# Altium project S7CAS-PLEIADES-CARTE-MERE.PrjPCB (part 3 of 3)

## Sheet CM_USB.SchDoc
size Tabloid; SheetNumber: 14; SheetTotal: 14; Sheet_Name: CM_USB; Size: 11x17
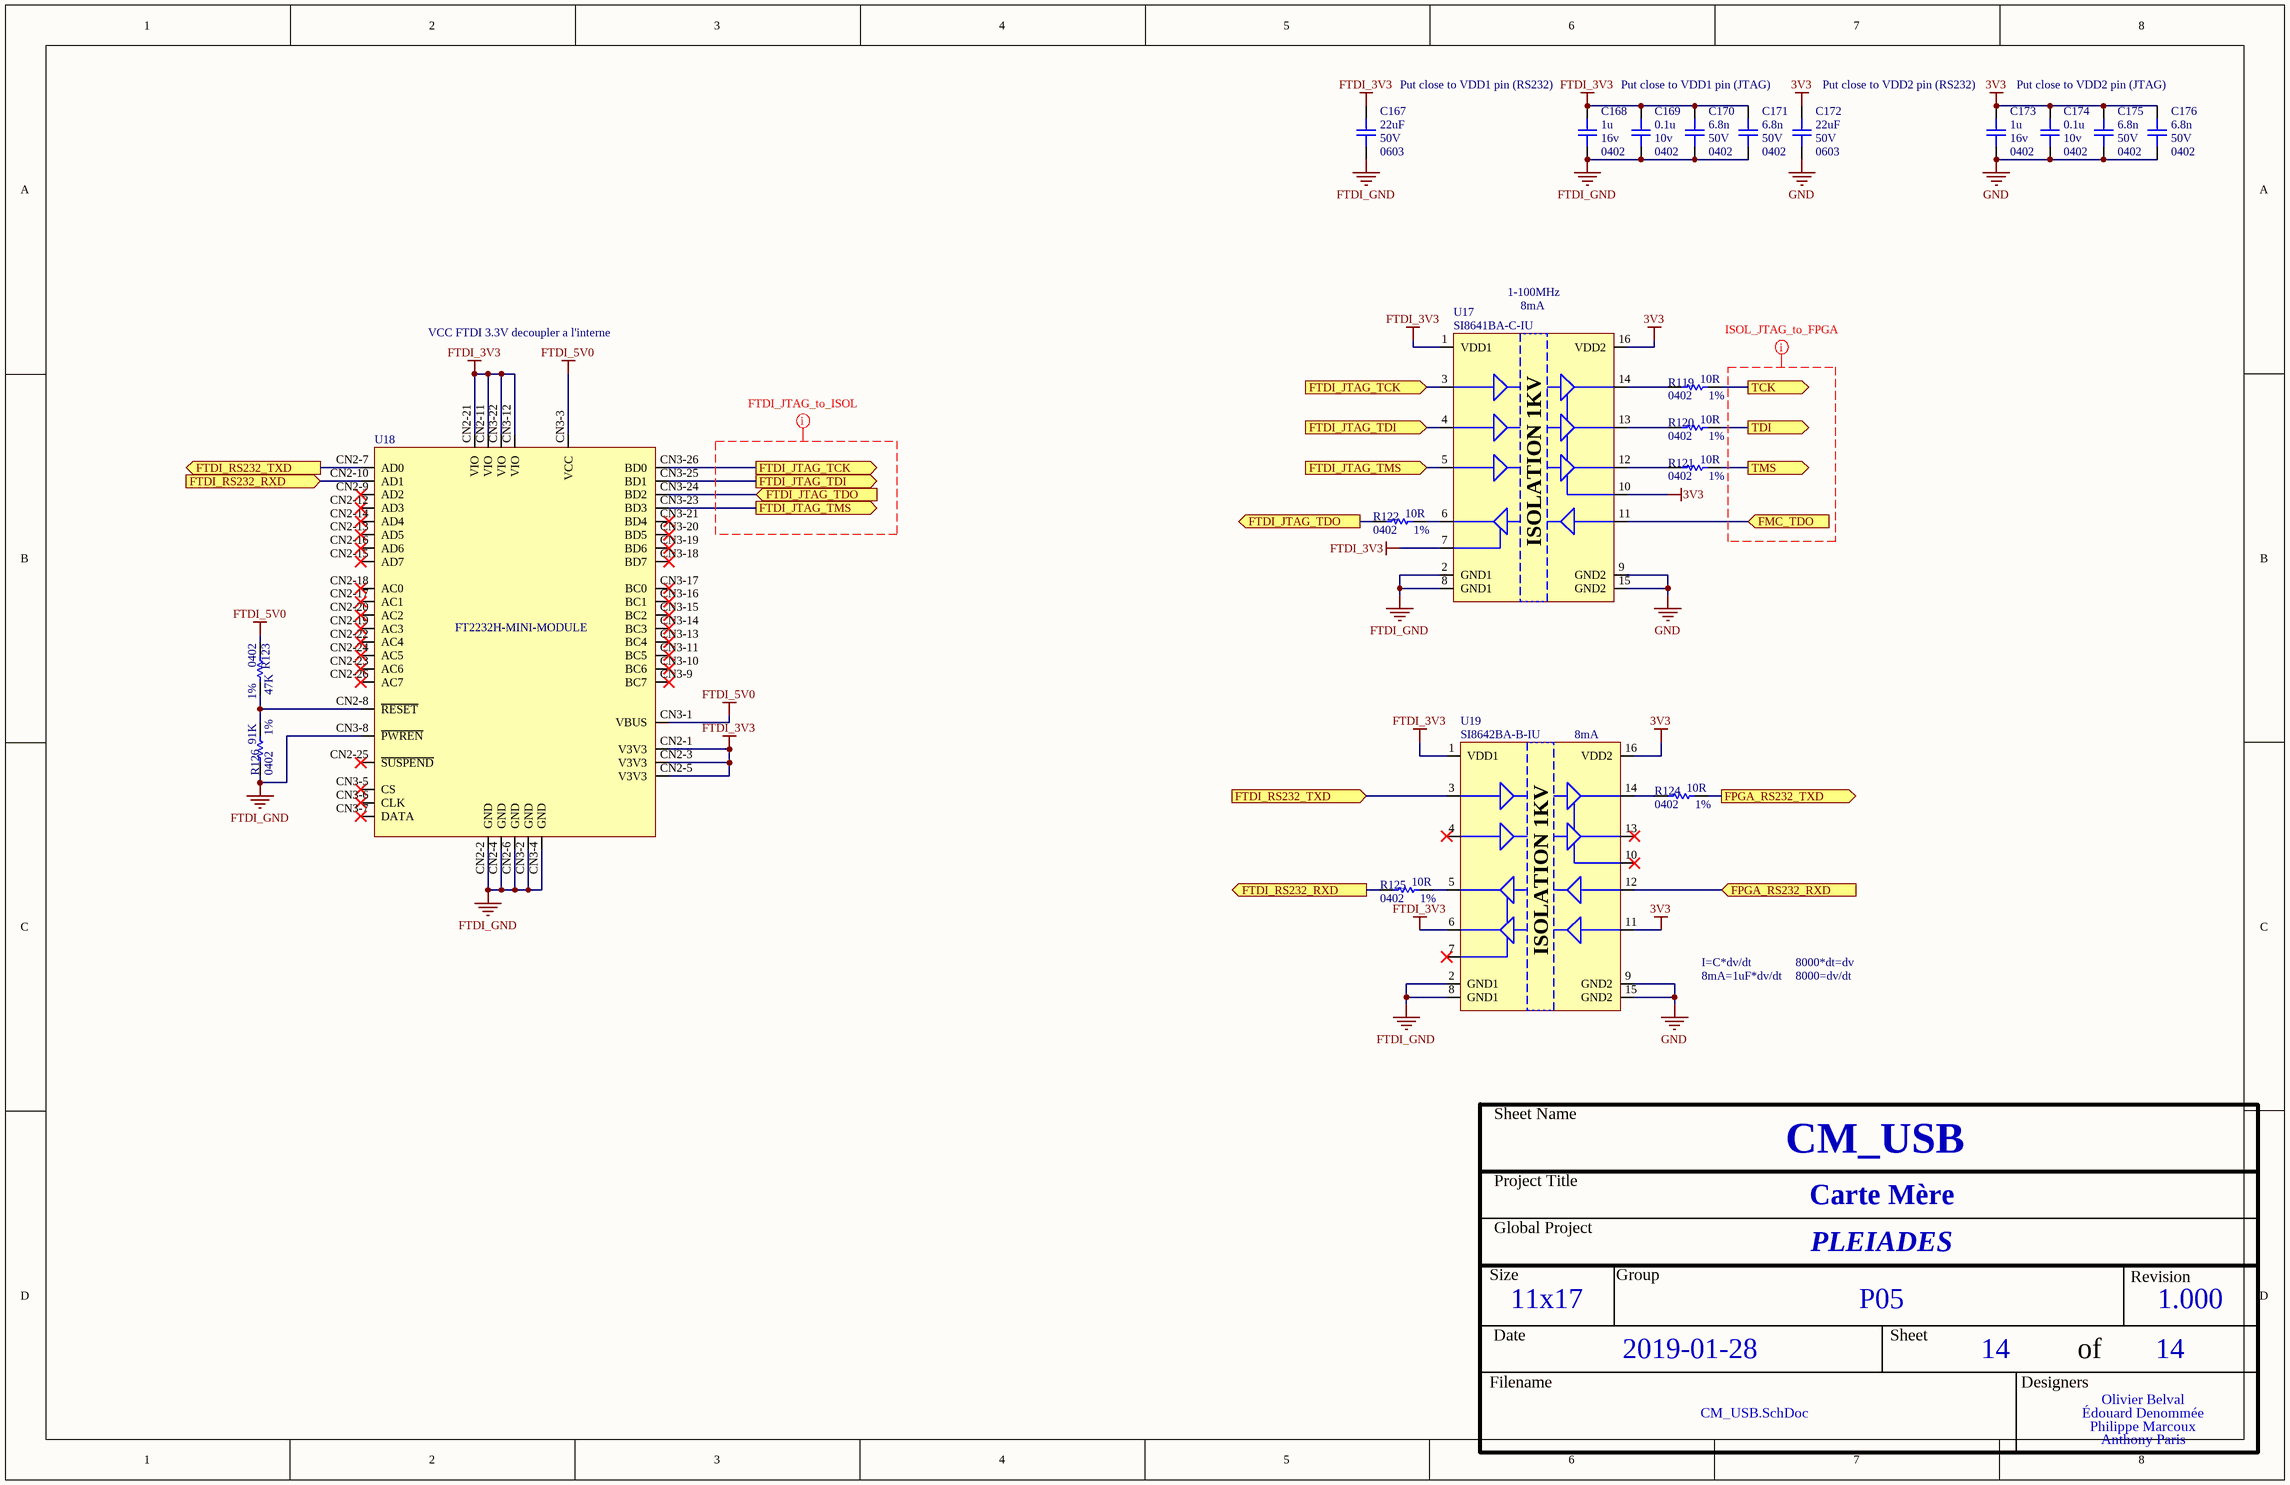
[diagram p13: CM_USB.SchDoc]

### Parts
C167  value 22uF  Voltage: 50V  Package: 0603  [CAP_0402]  (hidden comment: CAP - 0402)
C168  value 1u  Voltage: 16v  Package: 0402  [CAP_0402]  (hidden comment: CAP - 0402)
C169  value 0.1u  Voltage: 10v  Package: 0402  [CAP_0402]  (hidden comment: CAP - 0402)
C170  value 6.8n  Voltage: 50V  Package: 0402  [CAP_0402]  (hidden comment: CAP - 0402)
C171  value 6.8n  Voltage: 50V  Package: 0402  [CAP_0402]  (hidden comment: CAP - 0402)
C172  value 22uF  Voltage: 50V  Package: 0603  [CAP_0402]  (hidden comment: CAP - 0402)
C173  value 1u  Voltage: 16v  Package: 0402  [CAP_0402]  (hidden comment: CAP - 0402)
C174  value 0.1u  Voltage: 10v  Package: 0402  [CAP_0402]  (hidden comment: CAP - 0402)
C175  value 6.8n  Voltage: 50V  Package: 0402  [CAP_0402]  (hidden comment: CAP - 0402)
C176  value 6.8n  Voltage: 50V  Package: 0402  [CAP_0402]  (hidden comment: CAP - 0402)
R119  value 10R  Package: 0402  Precision: 1%  [RES_0402]  (hidden comment: RES - 0402)
R120  value 10R  Package: 0402  Precision: 1%  [RES_0402]  (hidden comment: RES - 0402)
R121  value 10R  Package: 0402  Precision: 1%  [RES_0402]  (hidden comment: RES - 0402)
R122  value 10R  Package: 0402  Precision: 1%  [RES_0402]  (hidden comment: RES - 0402)
R123  value 47K  Package: 0402  Precision: 1%  [RES_0402]  (hidden comment: RES - 0402)
R124  value 10R  Package: 0402  Precision: 1%  [RES_0402]  (hidden comment: RES - 0402)
R125  value 10R  Package: 0402  Precision: 1%  [RES_0402]  (hidden comment: RES - 0402)
R126  value 91K  Package: 0402  Precision: 1%  [RES_0402]  (hidden comment: RES - 0402)
U17  SI8641BA-C-IU  [ISO_SI8642BA-B-IU]
U18  FT2232H-MINI-MODULE  [COM_USB_FT2232H-MINI-MODULE]
U19  SI8642BA-B-IU  [ISO_SI8642BA-B-IU]

### Ports
FMC_TDO (in), FPGA_RS232_RXD (in), FPGA_RS232_TXD (out), FTDI_JTAG_TCK (in), FTDI_JTAG_TCK (out), FTDI_JTAG_TDI (in), FTDI_JTAG_TDI (out), FTDI_JTAG_TDO (in), FTDI_JTAG_TDO (out), FTDI_JTAG_TMS (in), FTDI_JTAG_TMS (out), FTDI_RS232_RXD (in), FTDI_RS232_RXD (out), FTDI_RS232_TXD (in), FTDI_RS232_TXD (out), TCK (out), TDI (out), TMS (out)

### Nets
3V3: C172.2 C173.2 C174.2 C175.2 C176.2 U17.10(EN2) U17.16(VDD2) U19.11(B4) U19.16(VDD2)
FTDI_3V3: C167.2 C168.2 C169.2 C170.2 C171.2 U17.1(VDD1) U17.7(EN1) U18.CN2-1(V3V3) U18.CN2-3(V3V3) U18.CN2-5(V3V3) U18.CN2-11(VIO) U18.CN2-21(VIO) U18.CN3-12(VIO) U18.CN3-22(VIO) U19.1(VDD1) U19.6(A4)
FTDI_5V0: R123.1 U18.CN3-1(VBUS) U18.CN3-3(VCC)
FTDI_GND: C167.1 C168.1 C169.1 C170.1 C171.1 R126.1 U17.2(GND1) U17.8(GND1) U18.CN2-2(GND) U18.CN2-4(GND) U18.CN2-6(GND) U18.CN3-2(GND) U18.CN3-4(GND) U18.CN3-8(~{PWREN}) U19.2(GND1) U19.8(GND1)
GND: C172.1 C173.1 C174.1 C175.1 C176.1 U17.9(GND2) U17.15(GND2) U19.9(GND2) U19.15(GND2)
FMC_TDO: U17.11(B4) ; port FMC_TDO
FPGA_RS232_RXD: U19.12(B3) ; port FPGA_RS232_RXD
FPGA_RS232_TXD: R124.2 ; port FPGA_RS232_TXD
FTDI_JTAG_TCK: U17.3(A1) U18.CN3-26(BD0) ; port FTDI_JTAG_TCK
FTDI_JTAG_TDI: U17.4(A2) U18.CN3-25(BD1) ; port FTDI_JTAG_TDI
FTDI_JTAG_TDO: R122.1 U18.CN3-24(BD2) ; port FTDI_JTAG_TDO
FTDI_JTAG_TMS: U17.5(A3) U18.CN3-23(BD3) ; port FTDI_JTAG_TMS
FTDI_RS232_RXD: R125.1 U18.CN2-10(AD1) ; port FTDI_RS232_RXD
FTDI_RS232_TXD: U18.CN2-7(AD0) U19.3(A1) ; port FTDI_RS232_TXD
TCK: R119.2 ; port TCK
TDI: R121.2 ; port TDI
TMS: R120.2 ; port TMS
NetR119_1: R119.1 U17.14(B1)
NetR120_1: R120.1 U17.12(B3)
NetR121_1: R121.1 U17.13(B2)
NetR122_2: R122.2 U17.6(A4)
NetR123_2: R123.2 R126.2 U18.CN2-8(~{RESET})
NetR124_1: R124.1 U19.14(B1)
NetR125_2: R125.2 U19.5(A3)

Not connected (* = marked no-connect by the designer): U18 CN2-9(AD2)* CN2-12(AD3)* CN2-13(AD5)* CN2-14(AD4)* CN2-15(AD7)* CN2-16(AD6)* CN2-17(AC1)* CN2-18(AC0)* CN2-19(AC3)* CN2-20(AC2)* CN2-22(AC4)* CN2-23(AC6)* CN2-24(AC5)* CN2-25(~{SUSPEND})* CN2-26(AC7)* CN3-5(CS)* CN3-6(CLK)* CN3-7(DATA)* CN3-9(BC7)* CN3-10(BC6)* CN3-11(BC5)* CN3-13(BC4)* CN3-14(BC3)* CN3-15(BC2)* CN3-16(BC1)* CN3-17(BC0)* CN3-18(BD7)* CN3-19(BD6)* CN3-20(BD5)* CN3-21(BD4)*; U19 4(A2)* 7(EN1)* 10(EN2)* 13(B2)*

### Layout directives
net class FTDI_JTAG_to_ISOL: (no net found under the mark)
net class ISOL_JTAG_to_FPGA: (no net found under the mark)

### Notes on the sheet
- Put close to VDD1 pin (RS232)
- Put close to VDD1 pin (JTAG)
- Put close to VDD2 pin (RS232)
- Put close to VDD2 pin (JTAG)
- (near U17) 1-100MHz
- VCC FTDI 3.3V decoupler a l'interne
- (near U17) 8mA
- (near U19) 8mA
- I=C*dv/dt
- 8000*dt=dv
- 8mA=1uF*dv/dt
- 8000=dv/dt
- Sheet Name
- Project Title
- Global Project
- Size
- Group
- Revision
- Date
- Sheet
- of
- Filename
- Designers
- (in symbol ISO_SI8641BA-C-IU) ISOLATION 1KV
- (in symbol ISO_SI8642BA-B-IU) ISOLATION 1KV

### Library data of the parts
C167-C176 = CAP - 0402: Precision: 10%; Current: *; CreatedBy: Jonathan Bouchard; Power: *
R119-R126 = RES - 0402: Voltage: 50V; Power: 1/16W; Current: *; CreatedBy: Jonathan Bouchard
U17 = ISO_SI8641BA-C-IU: ISO - DIGITAL ISOLATOR 1KV 4CH 3:1 GEN PURP -  SOP-16; Voltage: 2.5 V ~ 5.5 V; Mfg: Silicon Labs; Current: *; Power: *; Mfg Part Number: SI8641BA-C-IU; HelpURL: http://www.silabs.com/Support%20Documents/TechnicalDocs/si864x-datasheet.pdf; CreatedBy: Jonathan Bouchard; Temperature: -40°C ~ 125°C; Value: *; Precision: *; Package: SOP-16; Supplier 1: Digikey; Supplier Part Number 1: SI8641BA-C-IU-ND
U18 = COM_USB_FT2232H-MINI-MODULE: COM - USB FTDI FT2232H Mini-Module - TH; Mfg: Micrel; Voltage: *; Current: *; Power: *; Mfg Part Number: FT2232H-MINI-MODULE; HelpURL: http://www.ftdichip.com/Support/Documents/DataSheets/Modules/DS_FT2232H_Mini_Module.pdf; CreatedBy: Jonathan Bouchard; Temperature: *; Value: *; Precision: *; Package: TH; Supplier 1: Digikey; Supplier Part Number 1: 768-1030-ND
U19 = ISO_SI8642BA-B-IU: ISO - DIGITAL ISOLATOR 1KV 4CH 2:2 GEN PURP -  SOP-16; Voltage: 2.5 V ~ 5.5 V; Mfg: Silicon Labs; Current: *; Power: *; Mfg Part Number: SI8642BA-B-IU; HelpURL: http://www.silabs.com/Support%20Documents/TechnicalDocs/si864x-datasheet.pdf; CreatedBy: Jonathan Bouchard; Temperature: -40°C ~ 125°C; Value: *; Precision: *; Package: SOP-16; Supplier 1: Digikey; Supplier Part Number 1: 336-2091-5-ND

## Nets that join several sheets
1V2: CM_ALIM (5 pins), CM_FPGA_JTAG_POWER_FLASH (31 pins)
1V5: CM_ALIM (11 pins), CM_FPGA_B2-3 (15 pins), CM_DDR3 (30 pins)
3V3: CM_ALIM (11 pins), CM_FPGA_B0-1 (17 pins), CM_FPGA_B2-3 (18 pins), CM_FPGA_B4-5 (22 pins), CM_FPGA_JTAG_POWER_FLASH (49 pins), CM_CLK (13 pins), CM_DDR3 (C76.1 U9.6 U9.7), CM_MOTOR (9 pins), CM_ETHERNET (20 pins), CM_FMC-HPC-AB (9 pins), CM_FMC-HPC-CDE (R96.2), CM_USB (9 pins)
12V0: CM_ALIM (8 pins), CM_FPGA_JTAG_POWER_FLASH (F2.+), CM_FMC-HPC-AB (J3.C35 J3.C37)
24V0: CM_ALIM (C4.2 D8.3 Q1.S U1.2), CM_FPGA_JTAG_POWER_FLASH (D3.A), CM_MOTOR (7 pins)
GND: CM_Title (MH3.1 MH7.1 MH8.1), CM_ALIM (35 pins), CM_FPGA_B0-1 (10 pins), CM_FPGA_B2-3 (13 pins), CM_FPGA_B4-5 (8 pins), CM_FPGA_JTAG_POWER_FLASH (115 pins), CM_CLK (35 pins), CM_DDR3 (52 pins), CM_MOTOR (19 pins), CM_ETHERNET (35 pins), CM_FMC-HPC-AB (79 pins), CM_FMC-HPC-CDE (86 pins), CM_USB (9 pins)
GND_CHASSIS: CM_Title (MH4.1), CM_ETHERNET (C95.1)
VIO_B_M2C: CM_FPGA_B0-1 (14 pins), CM_FMC-HPC-CDE (J3.J39 J3.K40)
VREF: CM_FPGA_B2-3 (U12.AD7 U12.L6 U12.R6 U12.V6), CM_DDR3 (C78.2 U8.H1 U8.M8 U9.4)
~{DDR_CAS}: CM_FPGA_B2-3 (U12.P8), CM_DDR3 (R22.2 U8.K3)
~{DDR_RAS}: CM_FPGA_B2-3 (U12.N8), CM_DDR3 (R22.1 U8.J3)
~{DDR_RESET}: CM_FPGA_B2-3 (U12.L4), CM_DDR3 (R21.1 U8.T2)
~{DDR_WE}: CM_FPGA_B2-3 (U12.P5), CM_DDR3 (R24.2 U8.L3)
CDCE_CLK_100M_N: CM_FPGA_B0-1 (U12.A15), CM_CLK (U7.10)
CDCE_CLK_100M_P: CM_FPGA_B0-1 (U12.C15), CM_CLK (U7.9)
CDCE_PLL_LOCK: CM_FPGA_B0-1 (U12.A14), CM_CLK (U7.37)
CDCE_PWRDN: CM_FPGA_B0-1 (U12.B16), CM_CLK (U7.12)
CDCE_SPI_CLK: CM_FPGA_B0-1 (U12.A18), CM_CLK (U7.24)
CDCE_SPI_LE: CM_FPGA_B0-1 (U12.C19), CM_CLK (U7.25)
CDCE_SPI_MISO: CM_FPGA_B0-1 (U12.A17), CM_CLK (U7.22)
CDCE_SPI_MOSI: CM_FPGA_B0-1 (U12.B18), CM_CLK (U7.23)
CDCE_SYNC: CM_FPGA_B0-1 (U12.A16), CM_CLK (U7.14)
DDR_A0: CM_FPGA_B2-3 (U12.N7), CM_DDR3 (R27.2 U8.N3)
DDR_A1: CM_FPGA_B2-3 (U12.N6), CM_DDR3 (R28.1 U8.P7)
DDR_A2: CM_FPGA_B2-3 (U12.R9), CM_DDR3 (R30.2 U8.P3)
DDR_A3: CM_FPGA_B2-3 (U12.P7), CM_DDR3 (R26.2 U8.N2)
DDR_A4: CM_FPGA_B2-3 (U12.N9), CM_DDR3 (R32.1 U8.P8)
DDR_A5: CM_FPGA_B2-3 (U12.R2), CM_DDR3 (R29.2 U8.P2)
DDR_A6: CM_FPGA_B2-3 (U12.R1), CM_DDR3 (R31.2 U8.R8)
DDR_A7: CM_FPGA_B2-3 (U12.P10), CM_DDR3 (R28.2 U8.R2)
DDR_A8: CM_FPGA_B2-3 (U12.N4), CM_DDR3 (R32.2 U8.T8)
DDR_A9: CM_FPGA_B2-3 (U12.N3), CM_DDR3 (R31.1 U8.R3)
DDR_A10: CM_FPGA_B2-3 (U12.M10), CM_DDR3 (R25.2 U8.L7)
DDR_A11: CM_FPGA_B2-3 (U12.L3), CM_DDR3 (R33.2 U8.R7)
DDR_A12: CM_FPGA_B2-3 (U12.M8), CM_DDR3 (R27.1 U8.N7)
DDR_A13: CM_FPGA_B2-3 (U12.M6), CM_DDR3 (R33.1 U8.T3)
DDR_BA0: CM_FPGA_B2-3 (U12.P3), CM_DDR3 (R26.1 U8.M2)
DDR_BA1: CM_FPGA_B2-3 (U12.P1), CM_DDR3 (R30.1 U8.N8)
DDR_BA2: CM_FPGA_B2-3 (U12.N5), CM_DDR3 (R29.1 U8.M3)
DDR_CK_N: CM_FPGA_B2-3 (U12.R3), CM_DDR3 (R24.1 U8.K7)
DDR_CK_P: CM_FPGA_B2-3 (U12.R4), CM_DDR3 (R23.2 U8.J7)
DDR_CKE: CM_FPGA_B2-3 (U12.M9), CM_DDR3 (R25.1 U8.K9)
DDR_DQ0: CM_FPGA_B2-3 (U12.Y3), CM_DDR3 (U8.E3)
DDR_DQ1: CM_FPGA_B2-3 (U12.Y1), CM_DDR3 (U8.F7)
DDR_DQ2: CM_FPGA_B2-3 (U12.W2), CM_DDR3 (U8.F2)
DDR_DQ3: CM_FPGA_B2-3 (U12.W1), CM_DDR3 (U8.F8)
DDR_DQ4: CM_FPGA_B2-3 (U12.T3), CM_DDR3 (U8.H3)
DDR_DQ5: CM_FPGA_B2-3 (U12.T1), CM_DDR3 (U8.H8)
DDR_DQ6: CM_FPGA_B2-3 (U12.U2), CM_DDR3 (U8.G2)
DDR_DQ7: CM_FPGA_B2-3 (U12.U1), CM_DDR3 (U8.H7)
DDR_DQ8: CM_FPGA_B2-3 (U12.AA2), CM_DDR3 (U8.D7)
DDR_DQ9: CM_FPGA_B2-3 (U12.AA1), CM_DDR3 (U8.C3)
DDR_DQ10: CM_FPGA_B2-3 (U12.AE2), CM_DDR3 (U8.C8)
DDR_DQ11: CM_FPGA_B2-3 (U12.AE1), CM_DDR3 (U8.C2)
DDR_DQ12: CM_FPGA_B2-3 (U12.AD3), CM_DDR3 (U8.A7)
DDR_DQ13: CM_FPGA_B2-3 (U12.AD1), CM_DDR3 (U8.A2)
DDR_DQ14: CM_FPGA_B2-3 (U12.AB3), CM_DDR3 (U8.B8)
DDR_DQ15: CM_FPGA_B2-3 (U12.AB1), CM_DDR3 (U8.A3)
DDR_LDM: CM_FPGA_B2-3 (U12.W3), CM_DDR3 (R13.2 U8.E7)
DDR_LDQS_N: CM_FPGA_B2-3 (U12.V1), CM_DDR3 (U8.G3)
DDR_LDQS_P: CM_FPGA_B2-3 (U12.V3), CM_DDR3 (U8.F3)
DDR_ODT: CM_FPGA_B2-3 (U12.P6), CM_DDR3 (R23.1 U8.K1)
DDR_UDM: CM_FPGA_B2-3 (U12.V4), CM_DDR3 (R13.1 U8.D3)
DDR_UDQS_N: CM_FPGA_B2-3 (U12.AC1), CM_DDR3 (U8.B7)
DDR_UDQS_P: CM_FPGA_B2-3 (U12.AC2), CM_DDR3 (U8.C7)
Debug_LED0: CM_FPGA_B0-1 (U12.B4), CM_FPGA_JTAG_POWER_FLASH (D4.A)
Debug_LED1: CM_FPGA_B0-1 (U12.A4), CM_FPGA_JTAG_POWER_FLASH (D5.A)
Debug_LED2: CM_FPGA_B0-1 (U12.A5), CM_FPGA_JTAG_POWER_FLASH (D6.A)
Debug_LED3: CM_FPGA_B0-1 (U12.B6), CM_FPGA_JTAG_POWER_FLASH (D7.A)
Driver_DIR: CM_FPGA_B4-5 (U12.C26), CM_MOTOR (U16.3)
Driver_ENABLE#: CM_FPGA_B4-5 (U12.A25), CM_MOTOR (U16.26)
Driver_HOME: CM_FPGA_B4-5 (U12.B26), CM_MOTOR (U16.2)
Driver_RESET#: CM_FPGA_B4-5 (U12.B23), CM_MOTOR (R114.2 U16.17)
Driver_SLEEP#: CM_FPGA_B4-5 (U12.B25), CM_MOTOR (U16.27)
Driver_SR#: CM_FPGA_B4-5 (U12.A23), CM_MOTOR (U16.16)
Driver_STEP: CM_FPGA_B4-5 (U12.B24), CM_MOTOR (U16.19)
Driver_USM0: CM_FPGA_B4-5 (U12.E26), CM_MOTOR (U16.13)
Driver_USM1: CM_FPGA_B4-5 (U12.D26), CM_MOTOR (U16.12)
FLASH_CLK: CM_FPGA_B2-3 (U12.AD22), CM_FPGA_JTAG_POWER_FLASH (R107.1 R113.2 U6.6)
FLASH_CSO#: CM_FPGA_B2-3 (U12.AF4), CM_FPGA_JTAG_POWER_FLASH (R106.1 U6.1)
FLASH_MISO: CM_FPGA_B2-3 (U12.AD20), CM_FPGA_JTAG_POWER_FLASH (R108.1)
FLASH_MOSI: CM_FPGA_B2-3 (U12.AF20), CM_FPGA_JTAG_POWER_FLASH (U6.2)
FMC_GA0: CM_FPGA_B4-5 (U12.N25), CM_FMC-HPC-AB (J3.C34)
FMC_GA1: CM_FPGA_B4-5 (U12.N26), CM_FMC-HPC-AB (J3.D35)
FMC_SCL: CM_FPGA_B4-5 (R9.1 U12.L25), CM_FMC-HPC-AB (J3.C30)
FMC_SDA: CM_FPGA_B4-5 (R10.1 U12.L26), CM_FMC-HPC-AB (J3.C31)
FMC_TDI: CM_FPGA_JTAG_POWER_FLASH (U12.A24 W1.1), CM_FMC-HPC-AB (J3.D30)
FMC_TDO: CM_FPGA_JTAG_POWER_FLASH (J4.B04 W1.2), CM_FMC-HPC-AB (J3.D31), CM_USB (U17.11)
FPGA_RS232_RXD: CM_FPGA_B0-1 (U12.A2), CM_USB (U19.12)
FPGA_RS232_TXD: CM_FPGA_B0-1 (U12.A3), CM_USB (R124.2)
HA02_N: CM_FPGA_B2-3 (U12.U12), CM_FMC-HPC-CDE (J3.K8)
HA02_P: CM_FPGA_B2-3 (U12.U13), CM_FMC-HPC-CDE (J3.K7)
HA03_N: CM_FPGA_B2-3 (U12.AB10), CM_FMC-HPC-CDE (J3.J7)
HA03_P: CM_FPGA_B2-3 (U12.Y10), CM_FMC-HPC-CDE (J3.J6)
HA04_N: CM_FPGA_B2-3 (U12.W11), CM_FMC-HPC-CDE (J3.F8)
HA04_P: CM_FPGA_B2-3 (U12.V11), CM_FMC-HPC-CDE (J3.F7)
HA05_N: CM_FPGA_B2-3 (U12.AF8), CM_FMC-HPC-CDE (J3.E7)
HA05_P: CM_FPGA_B2-3 (U12.AD8), CM_FMC-HPC-CDE (J3.E6)
HA06_N: CM_FPGA_B2-3 (U12.AD9), CM_FMC-HPC-CDE (J3.K11)
HA06_P: CM_FPGA_B2-3 (U12.AC9), CM_FMC-HPC-CDE (J3.K10)
HA07_P: CM_FPGA_B2-3 (U12.AA9), CM_FMC-HPC-CDE (J3.J9)
HA08_N: CM_FPGA_B2-3 (U12.AF7), CM_FMC-HPC-CDE (J3.F11)
HA08_P: CM_FPGA_B2-3 (U12.AE7), CM_FMC-HPC-CDE (J3.F10)
HA09_N: CM_FPGA_B2-3 (U12.AF6), CM_FMC-HPC-CDE (J3.E10)
HA09_P: CM_FPGA_B2-3 (U12.AD6), CM_FMC-HPC-CDE (J3.E9)
HA10_N: CM_FPGA_B2-3 (U12.AF5), CM_FMC-HPC-CDE (J3.K14)
HA10_P: CM_FPGA_B2-3 (U12.AE5), CM_FMC-HPC-CDE (J3.K13)
HA11_P: CM_FPGA_B2-3 (U12.AE4), CM_FMC-HPC-CDE (J3.J12)
HB00_CC_N: CM_FPGA_B0-1 (U12.M21), CM_FMC-HPC-CDE (J3.K26)
HB00_CC_P: CM_FPGA_B0-1 (U12.N20), CM_FMC-HPC-CDE (J3.K25)
HB01_N: CM_FPGA_B0-1 (U12.L24), CM_FMC-HPC-CDE (J3.J25)
HB01_P: CM_FPGA_B0-1 (U12.L23), CM_FMC-HPC-CDE (J3.J24)
HB02_N: CM_FPGA_B0-1 (U12.N21), CM_FMC-HPC-CDE (J3.F23)
HB02_P: CM_FPGA_B0-1 (U12.P20), CM_FMC-HPC-CDE (J3.F22)
HB03_N: CM_FPGA_B0-1 (U12.N24), CM_FMC-HPC-CDE (J3.E22)
HB03_P: CM_FPGA_B0-1 (U12.M23), CM_FMC-HPC-CDE (J3.E21)
HB04_N: CM_FPGA_B0-1 (U12.K18), CM_FMC-HPC-CDE (J3.F26)
HB04_P: CM_FPGA_B0-1 (U12.L17), CM_FMC-HPC-CDE (J3.F25)
HB05_N: CM_FPGA_B0-1 (U12.P26), CM_FMC-HPC-CDE (J3.E25)
HB05_P: CM_FPGA_B0-1 (U12.P24), CM_FMC-HPC-CDE (J3.E24)
HB06_CC_N: CM_FPGA_B0-1 (U12.P22), CM_FMC-HPC-CDE (J3.K29)
HB06_CC_P: CM_FPGA_B0-1 (U12.P21), CM_FMC-HPC-CDE (J3.K28)
HB07_N: CM_FPGA_B0-1 (U12.L18), CM_FMC-HPC-CDE (J3.J28)
HB07_P: CM_FPGA_B0-1 (U12.M19), CM_FMC-HPC-CDE (J3.J27)
HB08_N: CM_FPGA_B0-1 (U12.R26), CM_FMC-HPC-CDE (J3.F29)
HB08_P: CM_FPGA_B0-1 (U12.R25), CM_FMC-HPC-CDE (J3.F28)
HB09_N: CM_FPGA_B0-1 (U12.N19), CM_FMC-HPC-CDE (J3.E28)
HB09_P: CM_FPGA_B0-1 (U12.M18), CM_FMC-HPC-CDE (J3.E27)
HB10_N: CM_FPGA_B0-1 (U12.N23), CM_FMC-HPC-CDE (J3.K32)
HB10_P: CM_FPGA_B0-1 (U12.N22), CM_FMC-HPC-CDE (J3.K31)
HB11_N: CM_FPGA_B0-1 (U12.N18), CM_FMC-HPC-CDE (J3.J31)
HB11_P: CM_FPGA_B0-1 (U12.N17), CM_FMC-HPC-CDE (J3.J30)
HB12_N: CM_FPGA_B0-1 (U12.R24), CM_FMC-HPC-CDE (J3.F32)
HB12_P: CM_FPGA_B0-1 (U12.R23), CM_FMC-HPC-CDE (J3.F31)
HB13_N: CM_FPGA_B0-1 (U12.W26), CM_FMC-HPC-CDE (J3.E31)
HB13_P: CM_FPGA_B0-1 (U12.W25), CM_FMC-HPC-CDE (J3.E30)
HB14_N: CM_FPGA_B0-1 (U12.V26), CM_FMC-HPC-CDE (J3.K35)
HB14_P: CM_FPGA_B0-1 (U12.V24), CM_FMC-HPC-CDE (J3.K34)
HB15_N: CM_FPGA_B0-1 (U12.T26), CM_FMC-HPC-CDE (J3.J34)
HB15_P: CM_FPGA_B0-1 (U12.T24), CM_FMC-HPC-CDE (J3.J33)
HB16_N: CM_FPGA_B0-1 (U12.Y26), CM_FMC-HPC-CDE (J3.F35)
HB16_P: CM_FPGA_B0-1 (U12.Y24), CM_FMC-HPC-CDE (J3.F34)
HB17_CC_N: CM_FPGA_B0-1 (U12.W24), CM_FMC-HPC-CDE (J3.K38)
HB17_CC_P: CM_FPGA_B0-1 (U12.V23), CM_FMC-HPC-CDE (J3.K37)
HB18_N: CM_FPGA_B0-1 (U12.AD26), CM_FMC-HPC-CDE (J3.J37)
HB18_P: CM_FPGA_B0-1 (U12.AD24), CM_FMC-HPC-CDE (J3.J36)
HB19_N: CM_FPGA_B0-1 (U12.AB26), CM_FMC-HPC-CDE (J3.E34)
HB19_P: CM_FPGA_B0-1 (U12.AB24), CM_FMC-HPC-CDE (J3.E33)
HB20_N: CM_FPGA_B0-1 (U12.AC26), CM_FMC-HPC-CDE (J3.F38)
HB20_P: CM_FPGA_B0-1 (U12.AC25), CM_FMC-HPC-CDE (J3.F37)
HB21_N: CM_FPGA_B0-1 (U12.AA26), CM_FMC-HPC-CDE (J3.E37)
HB21_P: CM_FPGA_B0-1 (U12.AA25), CM_FMC-HPC-CDE (J3.E36)
LA00_CC_N: CM_FPGA_B2-3 (U12.AF14), CM_FMC-HPC-CDE (J3.G7)
LA00_CC_P: CM_FPGA_B2-3 (U12.AD14), CM_FMC-HPC-CDE (J3.G6)
LA01_CC_N: CM_FPGA_B2-3 (U12.AF13), CM_FMC-HPC-AB (J3.D9)
LA01_CC_P: CM_FPGA_B2-3 (U12.AE13), CM_FMC-HPC-AB (J3.D8)
LA02_N: CM_FPGA_B2-3 (U12.AF21), CM_FMC-HPC-CDE (J3.H8)
LA02_P: CM_FPGA_B2-3 (U12.AE21), CM_FMC-HPC-CDE (J3.H7)
LA03_P: CM_FPGA_B2-3 (U12.AE19), CM_FMC-HPC-CDE (J3.G9)
LA04_N: CM_FPGA_B2-3 (U12.AD21), CM_FMC-HPC-CDE (J3.H11)
LA04_P: CM_FPGA_B2-3 (U12.AC20), CM_FMC-HPC-CDE (J3.H10)
LA05_N: CM_FPGA_B2-3 (U12.AA19), CM_FMC-HPC-AB (J3.D12)
LA05_P: CM_FPGA_B2-3 (U12.Y18), CM_FMC-HPC-AB (J3.D11)
LA06_N: CM_FPGA_B2-3 (U12.AD19), CM_FMC-HPC-AB (J3.C11)
LA06_P: CM_FPGA_B2-3 (U12.AC19), CM_FMC-HPC-AB (J3.C10)
LA07_N: CM_FPGA_B2-3 (U12.W17), CM_FMC-HPC-CDE (J3.H14)
LA07_P: CM_FPGA_B2-3 (U12.V16), CM_FMC-HPC-CDE (J3.H13)
LA08_N: CM_FPGA_B2-3 (U12.AF18), CM_FMC-HPC-CDE (J3.G13)
LA08_P: CM_FPGA_B2-3 (U12.AD18), CM_FMC-HPC-CDE (J3.G12)
LA09_N: CM_FPGA_B2-3 (U12.AA17), CM_FMC-HPC-AB (J3.D15)
LA09_P: CM_FPGA_B2-3 (U12.Y16), CM_FMC-HPC-AB (J3.D14)
LA10_N: CM_FPGA_B2-3 (U12.AB18), CM_FMC-HPC-AB (J3.C15)
LA10_P: CM_FPGA_B2-3 (U12.AA18), CM_FMC-HPC-AB (J3.C14)
LA11_N: CM_FPGA_B2-3 (U12.AF17), CM_FMC-HPC-CDE (J3.H17)
LA11_P: CM_FPGA_B2-3 (U12.AE17), CM_FMC-HPC-CDE (J3.H16)
LA12_N: CM_FPGA_B2-3 (U12.AF16), CM_FMC-HPC-CDE (J3.G16)
LA13_N: CM_FPGA_B2-3 (U12.AF15), CM_FMC-HPC-AB (J3.D18)
LA13_P: CM_FPGA_B2-3 (U12.AE15), CM_FMC-HPC-AB (J3.D17)
LA14_N: CM_FPGA_B2-3 (U12.AC17), CM_FMC-HPC-AB (J3.C19)
LA14_P: CM_FPGA_B2-3 (U12.AB17), CM_FMC-HPC-AB (J3.C18)
LA15_P: CM_FPGA_B2-3 (U12.AC15), CM_FMC-HPC-CDE (J3.H19)
LA16_N: CM_FPGA_B2-3 (U12.AD17), CM_FMC-HPC-CDE (J3.G19)
LA16_P: CM_FPGA_B2-3 (U12.AC16), CM_FMC-HPC-CDE (J3.G18)
LA17_CC_N: CM_FPGA_B2-3 (U12.AD13), CM_FMC-HPC-AB (J3.D21)
LA17_CC_P: CM_FPGA_B2-3 (U12.AC13), CM_FMC-HPC-AB (J3.D20)
LA18_CC_N: CM_FPGA_B2-3 (U12.AF12), CM_FMC-HPC-AB (J3.C23)
LA18_CC_P: CM_FPGA_B2-3 (U12.AD12), CM_FMC-HPC-AB (J3.C22)
LA19_N: CM_FPGA_B2-3 (U12.W16), CM_FMC-HPC-CDE (J3.H23)
LA19_P: CM_FPGA_B2-3 (U12.V15), CM_FMC-HPC-CDE (J3.H22)
LA20_N: CM_FPGA_B2-3 (U12.AC14), CM_FMC-HPC-CDE (J3.G22)
LA20_P: CM_FPGA_B2-3 (U12.AB15), CM_FMC-HPC-CDE (J3.G21)
LA21_N: CM_FPGA_B2-3 (U12.AA15), CM_FMC-HPC-CDE (J3.H26)
LA21_P: CM_FPGA_B2-3 (U12.Y15), CM_FMC-HPC-CDE (J3.H25)
LA22_N: CM_FPGA_B2-3 (U12.AA14), CM_FMC-HPC-CDE (J3.G25)
LA22_P: CM_FPGA_B2-3 (U12.Y14), CM_FMC-HPC-CDE (J3.G24)
LA23_N: CM_FPGA_B2-3 (U12.Y13), CM_FMC-HPC-AB (J3.D24)
LA23_P: CM_FPGA_B2-3 (U12.W13), CM_FMC-HPC-AB (J3.D23)
LA24_N: CM_FPGA_B2-3 (U12.AB13), CM_FMC-HPC-CDE (J3.H29)
LA24_P: CM_FPGA_B2-3 (U12.AA13), CM_FMC-HPC-CDE (J3.H28)
LA25_P: CM_FPGA_B2-3 (U12.AA12), CM_FMC-HPC-CDE (J3.G27)
LA26_N: CM_FPGA_B2-3 (U12.V14), CM_FMC-HPC-AB (J3.D27)
LA26_P: CM_FPGA_B2-3 (U12.U15), CM_FMC-HPC-AB (J3.D26)
LA27_N: CM_FPGA_B2-3 (U12.AB11), CM_FMC-HPC-AB (J3.C27)
LA27_P: CM_FPGA_B2-3 (U12.AA11), CM_FMC-HPC-AB (J3.C26)
LA28_N: CM_FPGA_B2-3 (U12.W14), CM_FMC-HPC-CDE (J3.H32)
LA28_P: CM_FPGA_B2-3 (U12.V13), CM_FMC-HPC-CDE (J3.H31)
LA29_N: CM_FPGA_B2-3 (U12.AD11), CM_FMC-HPC-CDE (J3.G31)
LA29_P: CM_FPGA_B2-3 (U12.AC11), CM_FMC-HPC-CDE (J3.G30)
LA30_N: CM_FPGA_B2-3 (U12.W12), CM_FMC-HPC-CDE (J3.H35)
LA30_P: CM_FPGA_B2-3 (U12.V12), CM_FMC-HPC-CDE (J3.H34)
LA31_N: CM_FPGA_B2-3 (U12.AF11), CM_FMC-HPC-CDE (J3.G34)
LA31_P: CM_FPGA_B2-3 (U12.AE11), CM_FMC-HPC-CDE (J3.G33)
LA32_P: CM_FPGA_B2-3 (U12.AE9), CM_FMC-HPC-CDE (J3.H37)
LA33_N: CM_FPGA_B2-3 (U12.AF10), CM_FMC-HPC-CDE (J3.G37)
LA33_P: CM_FPGA_B2-3 (U12.AD10), CM_FMC-HPC-CDE (J3.G36)
PB00: CM_FPGA_B0-1 (U12.A6), CM_FPGA_JTAG_POWER_FLASH (R104.2 SW2.1 SW2.4)
PB01: CM_FPGA_B0-1 (U12.A7), CM_FPGA_JTAG_POWER_FLASH (R105.2 SW3.1 SW3.4)
PHY_COL: CM_FPGA_B4-5 (U12.C1), CM_ETHERNET (R56.2)
PHY_CRS: CM_FPGA_B4-5 (U12.C2), CM_ETHERNET (R57.2)
PHY_INTRP: CM_FPGA_B4-5 (U12.H1), CM_ETHERNET (U10.21)
PHY_MDC: CM_FPGA_B4-5 (U12.N2), CM_ETHERNET (U10.12)
PHY_MDIO: CM_FPGA_B4-5 (U12.N1), CM_ETHERNET (R55.1 U10.11)
PHY_RST: CM_FPGA_B4-5 (U12.B2), CM_ETHERNET (R52.1 U10.32)
PHY_RXC: CM_FPGA_B4-5 (U12.J1), CM_ETHERNET (R66.2)
PHY_RXD0: CM_FPGA_B4-5 (U12.K3), CM_ETHERNET (R61.2 R73.2)
PHY_RXD1: CM_FPGA_B4-5 (U12.L2), CM_ETHERNET (R62.2)
PHY_RXD2: CM_FPGA_B4-5 (U12.L1), CM_ETHERNET (R64.2)
PHY_RXD3: CM_FPGA_B4-5 (U12.M1), CM_ETHERNET (R65.2)
PHY_RXDV: CM_FPGA_B4-5 (U12.K1), CM_ETHERNET (R59.2)
PHY_RXER: CM_FPGA_B4-5 (U12.J2), CM_ETHERNET (R60.2)
PHY_TXC: CM_FPGA_B4-5 (U12.G1), CM_ETHERNET (R53.1 U10.22)
PHY_TXD0: CM_FPGA_B4-5 (U12.F1), CM_ETHERNET (U10.24)
PHY_TXD1: CM_FPGA_B4-5 (U12.E1), CM_ETHERNET (U10.25)
PHY_TXD2: CM_FPGA_B4-5 (U12.E2), CM_ETHERNET (U10.26)
PHY_TXD3: CM_FPGA_B4-5 (U12.D1), CM_ETHERNET (U10.27)
PHY_TXEN: CM_FPGA_B4-5 (U12.G2), CM_ETHERNET (U10.23)
PHY_TXER: CM_FPGA_B4-5 (U12.B1), CM_ETHERNET (U10.31)
PRSNT_M2C_L: CM_FPGA_B4-5 (U12.M26), CM_FMC-HPC-CDE (J3.H2)
TCK: CM_FPGA_JTAG_POWER_FLASH (J4.B03 U12.E21), CM_FMC-HPC-AB (J3.D29), CM_USB (R119.2)
TDI: CM_FPGA_JTAG_POWER_FLASH (J4.B05 U12.F20), CM_USB (R121.2)
TEMP_SCLK: CM_FPGA_B4-5 (U12.G26), CM_FPGA_JTAG_POWER_FLASH (R101.1 U13.4 U14.4)
TEMP_SDA: CM_FPGA_B4-5 (U12.H26), CM_FPGA_JTAG_POWER_FLASH (R102.1 U13.5 U14.5)
TMS: CM_FPGA_JTAG_POWER_FLASH (J4.B02 U12.C23), CM_FMC-HPC-AB (J3.D33), CM_USB (R120.2)
VITTA_CLK0_N: CM_CLK (U7.20), CM_FMC-HPC-CDE (J3.K5)
VITTA_CLK0_P: CM_CLK (U7.19), CM_FMC-HPC-CDE (J3.K4)
VITTA_CLK1_N: CM_CLK (U7.17), CM_FMC-HPC-CDE (J3.J3)
VITTA_CLK1_P: CM_CLK (U7.16), CM_FMC-HPC-CDE (J3.J2)
VREF_A_M2C: CM_FPGA_B2-3 (5 pins), CM_FMC-HPC-CDE (J3.H1)
VREF_B_M2C: CM_FPGA_B0-1 (U12.AB22 U12.K19 U12.U24), CM_FMC-HPC-CDE (J3.K1)